# Altium schematic sheet connect.SchDoc
size A4
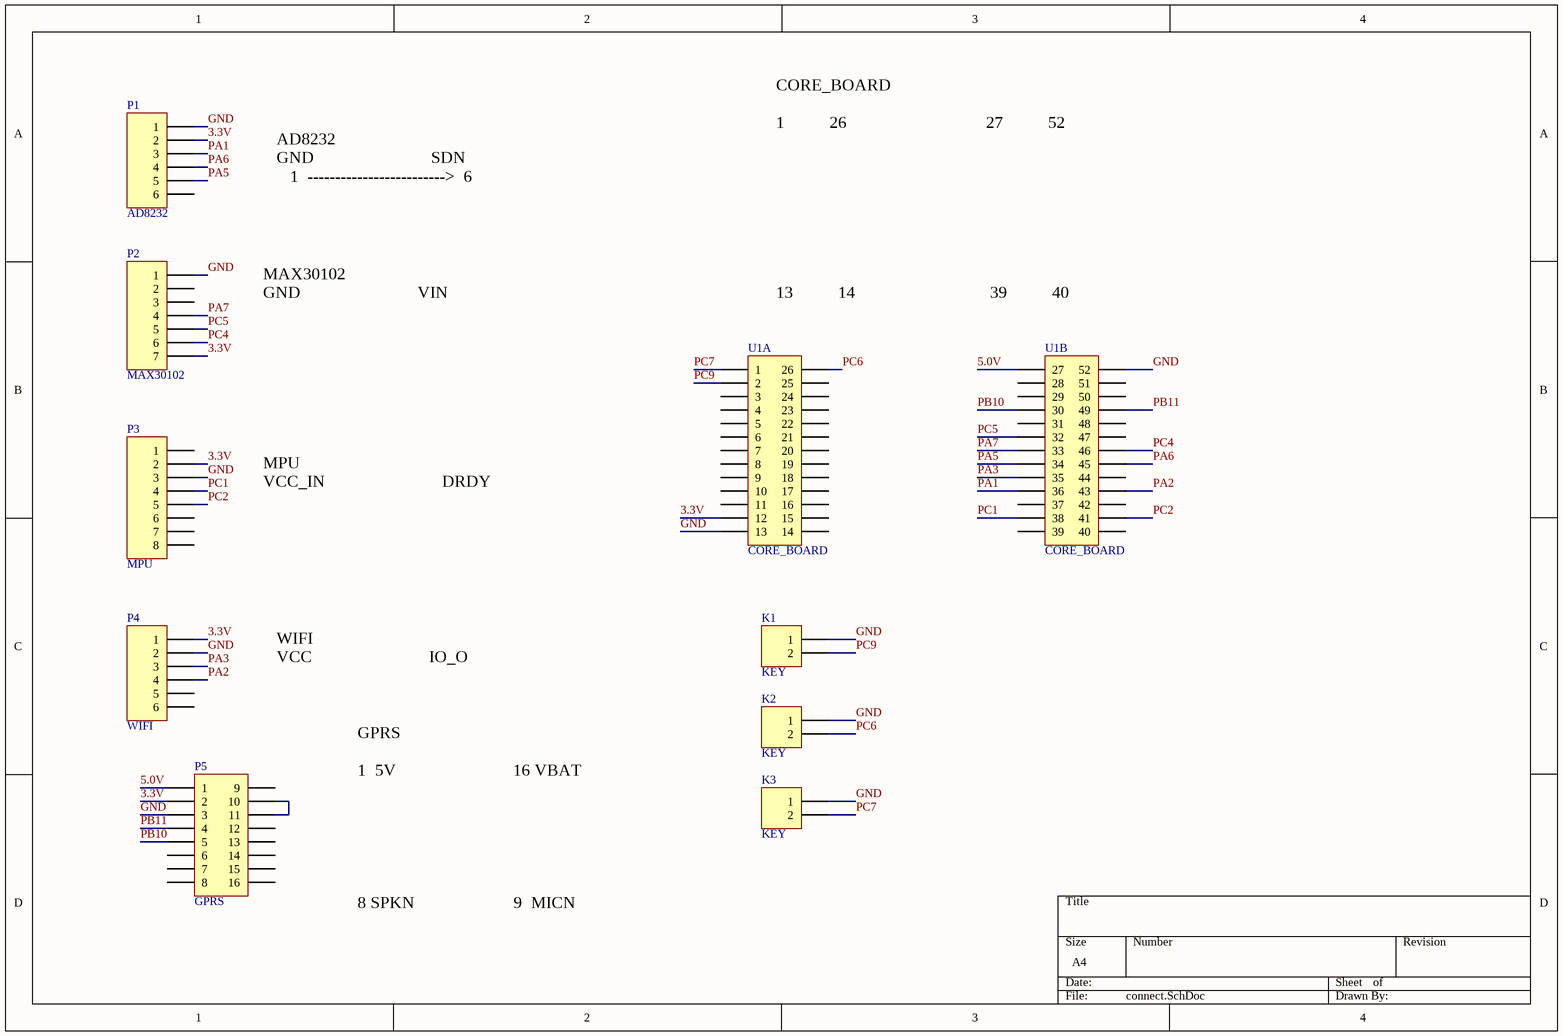
[diagram p0: connect.SchDoc]

## Parts
K1  KEY  [KEY]
K2  KEY  [KEY]
K3  KEY  [KEY]
P1  AD8232  [AD8232]
P2  MAX30102  [MAX30102]
P3  MPU  [MPU]
P4  WIFI  [WIFI]
P5  GPRS  [GPRS]
U1  CORE_BOARD  [CORE_BOARD]  (parts A,B of 2)

## Nets
3.3V: P1.2 P2.7 P3.2 P4.1 P5.2 U1.12
5.0V: P5.1 U1.27
GND: K1.1 K2.1 K3.1 P1.1 P2.1 P3.3 P4.2 P5.3 U1.13 U1.52
PA1: P1.3 U1.36
PA2: P4.4 U1.43
PA3: P4.3 U1.35
PA5: P1.5 U1.34
PA6: P1.4 U1.45
PA7: P2.4 U1.33
PB10: P5.5 U1.30
PB11: P5.4 U1.49
PC1: P3.4 U1.38
PC2: P3.5 U1.41
PC4: P2.6 U1.46
PC5: P2.5 U1.32
PC6: K2.2 U1.26
PC7: K3.2 U1.1
PC9: K1.2 U1.2
NetP5_10: P5.10 P5.11

Not connected (* = marked no-connect by the designer): P1 6; P2 2 3; P3 1 6 7 8; P4 5 6; P5 6 7 8 9 12 13 14 15 16; U1 3 4 5 6 7 8 9 10 11 14 15 16 17 18 19 20 21 22 23 24 25 28 29 31 37 39 40 42 44 47 48 50 51

## Notes on the sheet
- AD8232
  GND                          SDN
  1  ------------------------->  6
- MAX30102
  GND                          VIN
  1  ------------------------->  7
- CORE_BOARD
  1          26                               27          52
  13          14                              39          40
- MPU
  VCC_IN                          DRDY
  1  ------------------------->  8
- WIFI
  VCC                          IO_O
  1  ------------------------->  6
- GPRS
  1  5V                          16 VBAT
  8 SPKN                      9  MICN

## Library data of the parts
K1-K3 = KEY: LatestRevisionDate: 17-Jul-2002; LatestRevisionNote: Re-released for DXP Platform.; Publisher: Altium Limited
P1 = AD8232: LatestRevisionDate: 17-Jul-2002; LatestRevisionNote: Re-released for DXP Platform.; Publisher: Altium Limited
P2 = MAX30102: LatestRevisionDate: 17-Jul-2002; LatestRevisionNote: Re-released for DXP Platform.; Publisher: Altium Limited
P3 = MPU: LatestRevisionDate: 17-Jul-2002; LatestRevisionNote: Re-released for DXP Platform.; Publisher: Altium Limited
P4 = WIFI: LatestRevisionDate: 17-Jul-2002; LatestRevisionNote: Re-released for DXP Platform.; Publisher: Altium Limited
P5 = GPRS: LatestRevisionDate: 17-Jul-2002; LatestRevisionNote: Re-released for DXP Platform.; Publisher: Altium Limited